# Altium project BMS_AFE.PrjPcb (part 2 of 2)

## Sheet BMS AFE - Thermistors.SchDoc: Title
size B; Organization: Midnight Sun Solar Rayce Car Team; Address1: University of Waterloo; Address2: 200 University Ave W; Address3: Waterloo, ON, Canada; Address4: N2L 3E9; DocumentNumber: 7; SheetNumber: 7; SheetTotal: 7; Website: www.uwmidsun.com; ProjectName: ProjectName
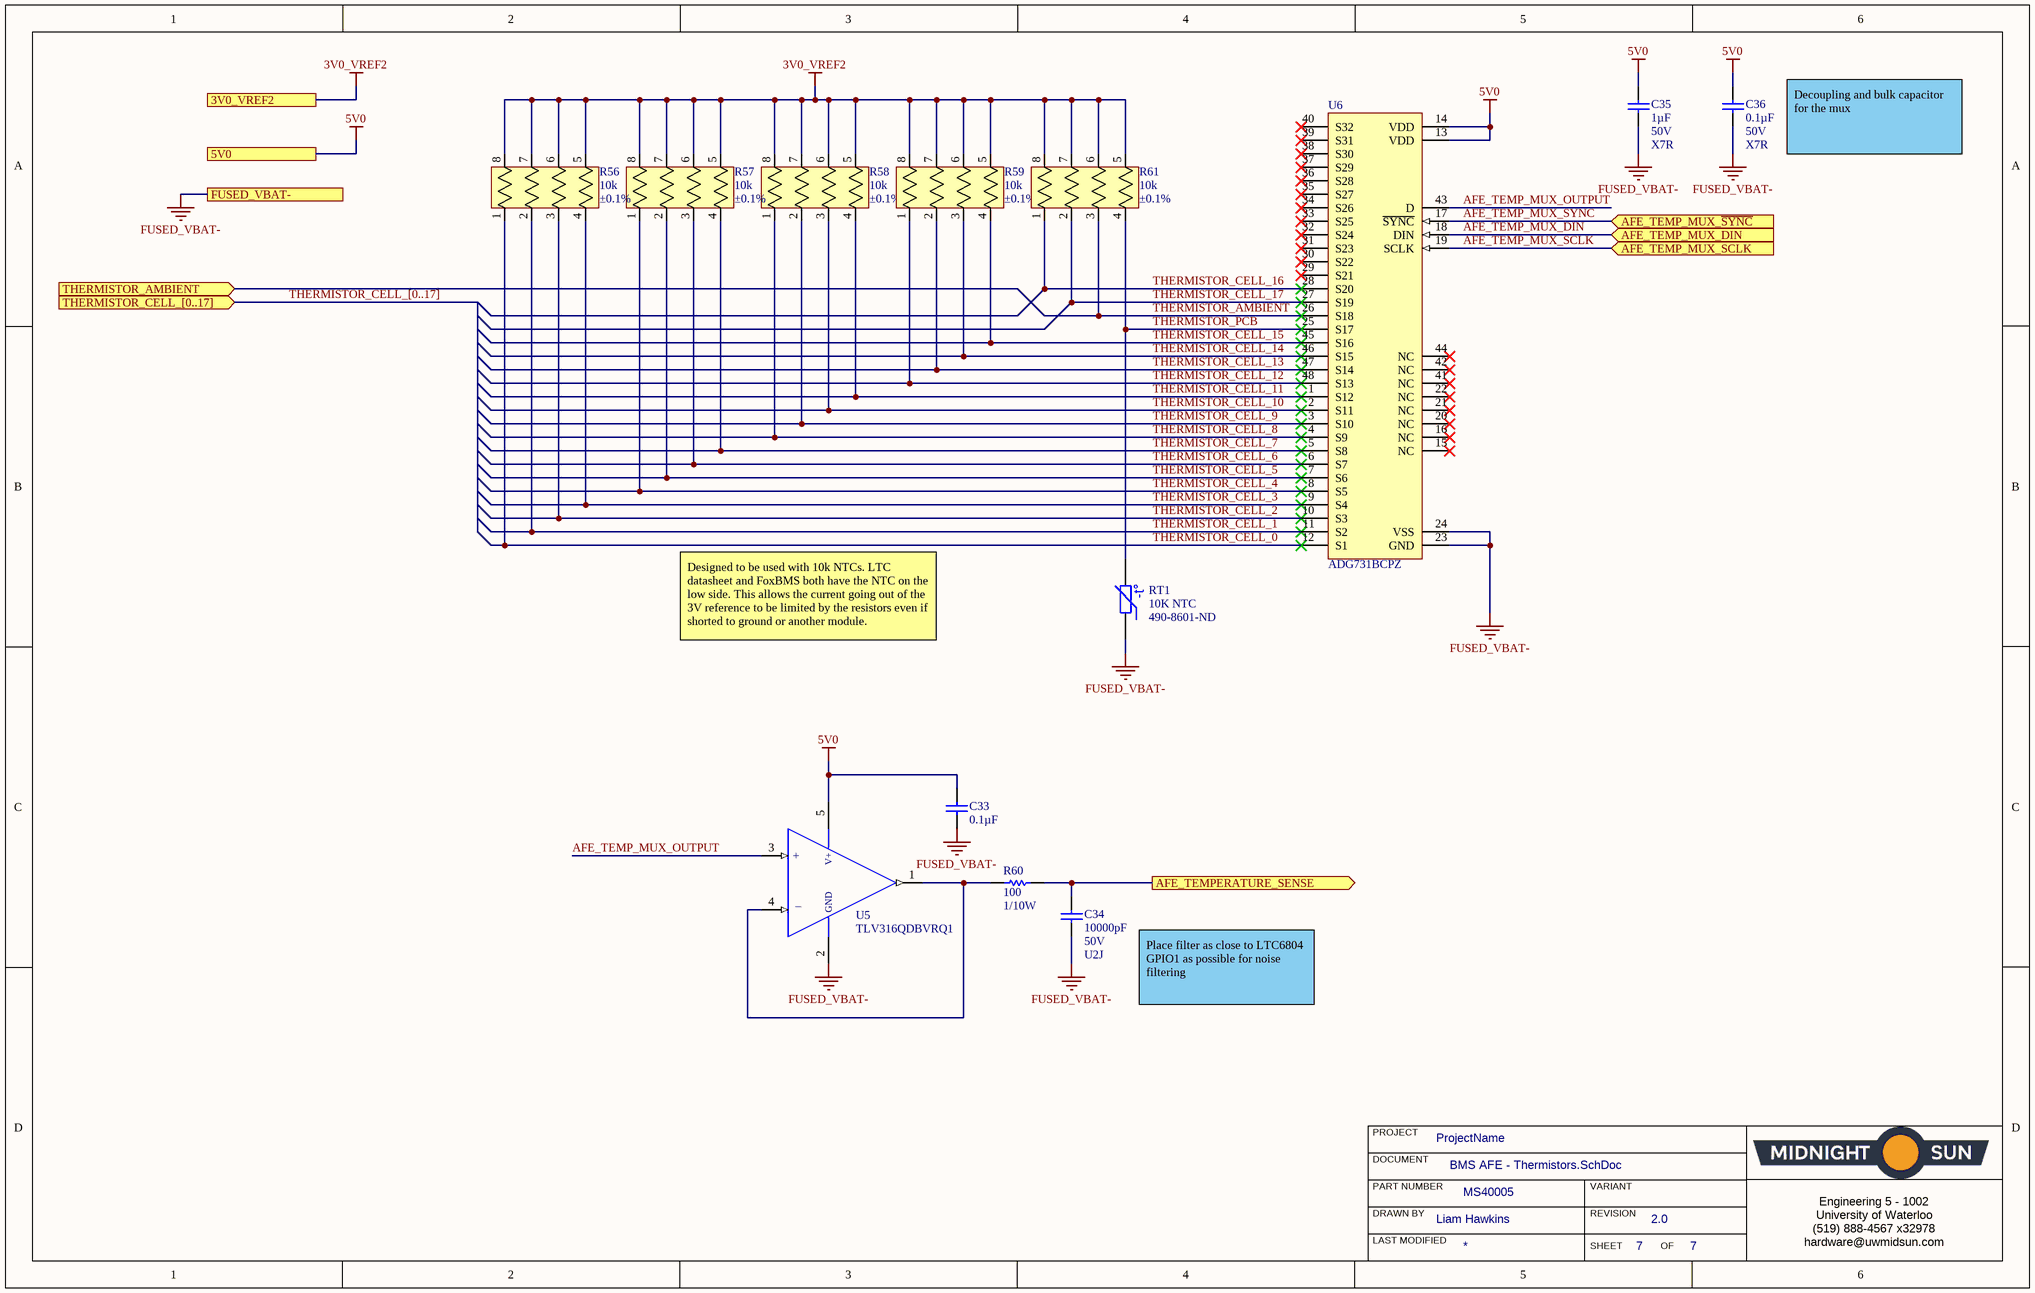
[diagram p5: BMS AFE - Thermistors.SchDoc]

### Parts
C33  Capacitance: 0.1µF  [CAP, 0603]  (hidden comment: CAP CER 0.1UF 50V 10% X7R 0603)
C34  Capacitance: 10000pF  Voltage: 50V  Temperature Coefficient: U2J  [CAP, 0603]  (hidden comment: CAP CER 10nF 50V 5% X7R 0603)
C35  Capacitance: 1µF  Voltage: 50V  Temperature Coefficient: X7R  [CAP, 0603]  (hidden comment: CAP CER 1UF 50V 10% X7R 0603)
C36  Capacitance: 0.1µF  Voltage: 50V  Temperature Coefficient: X7R  [CAP, 0603]  (hidden comment: CAP CER 0.1UF 50V 10% X7R 0603)
R56  Resistance (Ohms): 10k  Tolerance: ±0.1%  [RES ARRAY 4RES 1206]  (hidden comment: RES ARRAY 10K OHM 0.1% 4RES 1206)
R57  Resistance (Ohms): 10k  Tolerance: ±0.1%  [RES ARRAY 4RES 1206]  (hidden comment: RES ARRAY 10K OHM 0.1% 4RES 1206)
R58  Resistance (Ohms): 10k  Tolerance: ±0.1%  [RES ARRAY 4RES 1206]  (hidden comment: RES ARRAY 10K OHM 0.1% 4RES 1206)
R59  Resistance (Ohms): 10k  Tolerance: ±0.1%  [RES ARRAY 4RES 1206]  (hidden comment: RES ARRAY 10K OHM 0.1% 4RES 1206)
R60  Resistance: 100  Power: 1/10W  [RES, 0603]  (hidden comment: RES 100 OHM 1% 1/10W 0603)
R61  Resistance (Ohms): 10k  Tolerance: ±0.1%  [RES ARRAY 4RES 1206]  (hidden comment: RES ARRAY 10K OHM 0.1% 4RES 1206)
RT1  10K NTC  Supplier Part Number 1: 490-8601-ND  [NTC THERMISTOR BEAD]
U5  Manufacturer Part Number 1: TLV316QDBVRQ1  [IC OP AMP GP RR 10MHZ SOT-23-5]  (hidden comment: IC OP AMP GEN PURPOSE RR 10MHZ SOT-23-5)
U6  ADG731BCPZ  [TSQFP50P890X890X160-48M]

### Ports
3V0_VREF2, 5V0, AFE_TEMP_MUX_DIN (in), AFE_TEMP_MUX_SCLK (in), AFE_TEMP_MUX_~{SYNC} (in), AFE_TEMPERATURE_SENSE (out), FUSED_VBAT-, THERMISTOR_AMBIENT (in), THERMISTOR_CELL_[0..17] (in)

### Nets
3V0_VREF2: R56.5 R56.6 R56.7 R56.8 R57.5 R57.6 R57.7 R57.8 R58.5 R58.6 R58.7 R58.8 R59.5 R59.6 R59.7 R59.8 R61.5 R61.6 R61.7 R61.8 ; port 3V0_VREF2
5V0: C33.1 C35.1 C36.1 U5.5(VDD) U6.13(VDD) U6.14(VDD) ; port 5V0
FUSED_VBAT-: C33.2 C34.2 C35.2 C36.2 RT1.1 U5.2(VSS) U6.23(GND) U6.24(VSS) ; port FUSED_VBAT-
AFE_TEMP_MUX_DIN: U6.18(DIN) ; port AFE_TEMP_MUX_DIN
AFE_TEMP_MUX_OUTPUT: U5.3(+IN) U6.43(D)
AFE_TEMP_MUX_~{SYNC}: U6.17(~{SYNC}) ; port AFE_TEMP_MUX_~{SYNC}
AFE_TEMP_MUX_SCLK: U6.19(SCLK) ; port AFE_TEMP_MUX_SCLK
THERMISTOR_AMBIENT: R61.3 U6.26(S18) ; port THERMISTOR_AMBIENT
THERMISTOR_CELL_0: R56.1 U6.12(S1)
THERMISTOR_CELL_1: R56.2 U6.11(S2)
THERMISTOR_CELL_2: R56.3 U6.10(S3)
THERMISTOR_CELL_3: R56.4 U6.9(S4)
THERMISTOR_CELL_4: R57.1 U6.8(S5)
THERMISTOR_CELL_5: R57.2 U6.7(S6)
THERMISTOR_CELL_6: R57.3 U6.6(S7)
THERMISTOR_CELL_7: R57.4 U6.5(S8)
THERMISTOR_CELL_8: R58.1 U6.4(S9)
THERMISTOR_CELL_9: R58.2 U6.3(S10)
THERMISTOR_CELL_10: R58.3 U6.2(S11)
THERMISTOR_CELL_11: R58.4 U6.1(S12)
THERMISTOR_CELL_12: R59.1 U6.48(S13)
THERMISTOR_CELL_13: R59.2 U6.47(S14)
THERMISTOR_CELL_14: R59.3 U6.46(S15)
THERMISTOR_CELL_15: R59.4 U6.45(S16)
THERMISTOR_CELL_16: R61.1 U6.28(S20)
THERMISTOR_CELL_17: R61.2 U6.27(S19)
THERMISTOR_PCB: R61.4 RT1.2 U6.25(S17)
NetC34_1: C34.1 R60.2 ; port AFE_TEMPERATURE_SENSE
NetR60_1: R60.1 U5.1(OUTPUT) U5.4(-IN)

Not connected (* = marked no-connect by the designer): U6 15(NC)* 16(NC)* 20(NC)* 21(NC)* 22(NC)* 29(S21)* 30(S22)* 31(S23)* 32(S24)* 33(S25)* 34(S26)* 35(S27)* 36(S28)* 37(S29)* 38(S30)* 39(S31)* 40(S32)* 41(NC)* 42(NC)* 44(NC)*

### Buses and harness runs
bus THERMISTOR_CELL_[0..17] = port THERMISTOR_CELL_[0..17]

### Notes on the sheet
- Decoupling and bulk capacitor for the mux
- Designed to be used with 10k NTCs. LTC datasheet and FoxBMS both have the NTC on the low side. This allows the current going out of the 3V reference to be limited by the resistors even if shorted to ground or another module.
- Place filter as close to LTC6804 GPIO1 as possible for noise filtering
- PROJECT
- DOCUMENT
- DRAWN BY
- LAST MODIFIED
- PART NUMBER
- REVISION
- SHEET
- VARIANT
- OF
- Engineering 5 - 1002
  University of Waterloo
  (519) 888-4567 x32978
  hardware@uwmidsun.com
- (in symbol IC OP AMP GEN PURPOSE RR 10MHZ SOT-23-5) V+; +; GND; _
- (in symbol NTC THERMISTOR 10K 1% BEAD) -t°

### Library data of the parts
C33 C36 = CAP CER 0.1UF 50V 10% X7R 0603: 0.10µF ±10% 50V Ceramic Capacitor X7R 0603 (1608 Metric); Manufacturer 1: AVX Corporation; Manufacturer Part Number 1: 06035C104KAT2A; Supplier 1: Digi-Key; Supplier Part Number 1: 478-5052-1-ND; Packaging: Cut Tape (CT); Part Status: Active; Operating Temperature: -55°C ~ 125°C; Ratings: -; Mounting Type: Surface Mount, MLCC; Package / Case: 0603 (1608 Metric); Size / Dimension: 0.063" L x 0.032" W (1.60mm x 0.81mm); Height - Seated (Max): -; Thickness (Max): 0.035" (0.90mm); Lead Spacing: -; Lead Style: -; ComponentLink1URL: http://datasheets.avx.com/X7RDielectric.pdf; ComponentLink1Description: http://datasheets.avx.com/X7RDielectric.pdf; Tolerance: ±10%
  C33: Voltage: 50V; Temperature Coefficient: X7R
C34 = CAP CER 10nF 50V 5% X7R 0603: 10000pF ±5% 50V Ceramic Capacitor U2J 0603 (1608 Metric); Manufacturer 1: KEMET; Manufacturer Part Number 1: C0603C103J5JAC7867; Supplier 1: Digi-Key; Supplier Part Number 1: 399-13384-1-ND; Packaging: Cut Tape (CT); Part Status: Active; Operating Temperature: -55°C ~ 125°C; Ratings: -; Failure Rate: -; Mounting Type: Surface Mount, MLCC; Package / Case: 0603 (1608 Metric); Size / Dimension: 0.063" L x 0.032" W (1.60mm x 0.80mm); Height - Seated (Max): -; Thickness (Max): 0.034" (0.87mm); Lead Spacing: -; Lead Style: -; ComponentLink1URL: http://www.kemet.com/docfinder?Partnumber=C0603C103J5JAC7867; ComponentLink1Description: http://www.kemet.com/docfinder?Partnumber=C0603C103J5JAC7867; Tolerance: ±5%
C35 = CAP CER 1UF 50V 10% X7R 0603: 1µF ±10% 50V Ceramic Capacitor X7R 0603 (1608 Metric); Manufacturer 1: Taiyo Yuden; Manufacturer Part Number 1: UMK107AB7105KA-T; Supplier 1: Digi-Key; Supplier Part Number 1: 587-3247-1-ND; Packaging: Cut Tape (CT); Part Status: Active; Operating Temperature: -55°C ~ 125°C; Ratings: -; Mounting Type: Surface Mount, MLCC; Package / Case: 0603 (1608 Metric); Size / Dimension: 0.063" L x 0.031" W (1.60mm x 0.80mm); Height - Seated (Max): -; Thickness (Max): 0.037" (0.95mm); Lead Spacing: -; Lead Style: -; ComponentLink1URL: http://www.yuden.co.jp/productdata/catalog/en/mlcc_all_e.pdf; ComponentLink1Description: http://www.yuden.co.jp/productdata/catalog/en/mlcc_all_e.pdf; Tolerance: ±10%
R56-R59 R61 = RES ARRAY 10K OHM 0.1% 4RES 1206: 10k Ohm ±0.1% 100mW Power Per Element Isolated 4 Resistor Network/Array ±25ppm/°C 1206 (3216 Metric), Convex, Long Side Terminals; Manufacturer: Vishay Beyschlag; Manufacturer Part Number: ACASA1002S1002P100; Number of Resistors: 4; Resistor Matching Ratio: ±0.05%; Resistor-Ratio-Drift: ±15 ppm/°C; Supplier 1: Digi-Key; RoHS: RoHS Compliant; Category: Resistors; Stock 1: 18780; Pricing 1: 1=1.19, 10=0.99, 25=0.8484, 50=0.7636, 100=0.6647, 250=0.59392, 500=0.4808 (CAD); Packaging: Cut Tape (CT); Part Status: Active; Circuit Type: Isolated; Power Per Element: 100mW; Temperature Coefficient: ±25ppm/°C; Operating Temperature: -55°C ~ 125°C; Applications: Voltage Divider (TCR Matched); Mounting Type: Surface Mount; Package / Case: 1206 (3216 Metric), Convex, Long Side Terminals; Supplier Device Package: 0612; Size / Dimension: 0.126" L x 0.059" W (3.20mm x 1.50mm); Height - Seated (Max): 0.022" (0.55mm); ComponentLink1URL: http://www.vishay.com/docs/28751/acasprec.pdf; ComponentLink1Description: http://www.vishay.com/docs/28751/acasprec.pdf; Supplier Part Number 1: 749-1023-1-ND
R60 = RES 100 OHM 1% 1/10W 0603: 100 Ohm ±1% 0.1W, 1/10W Chip Resistor 0603 (1608 Metric) Moisture Resistant Thick Film; Manufacturer 1: Yageo; Manufacturer Part Number 1: RC0603FR-07100RL; Temperature Coefficient: ±100ppm/°C; Supplier 1: Digi-Key; Supplier Part Number 1: 311-100HRCT-ND; Packaging: Cut Tape (CT); Part Status: Active; Composition: Thick Film; Operating Temperature: -55°C ~ 155°C; Package / Case: 0603 (1608 Metric); Supplier Device Package: 0603; Size / Dimension: 0.063" L x 0.031" W (1.60mm x 0.80mm); Height - Seated (Max): 0.022" (0.55mm); Failure Rate: -; ComponentLink1URL: http://www.yageo.com/documents/recent/PYu-RC_Group_51_RoHS_L_7.pdf; ComponentLink1Description: http://www.yageo.com/documents/recent/PYu-RC_Group_51_RoHS_L_7.pdf; Tolerance: ±1%
RT1 = NTC THERMISTOR 10K 1% BEAD: NTC Thermistor 10k Bead; Manufacturer: Murata Electronics North America; Manufacturer Part Number: NXRT15XH103FA1B030; Resistance Tolerance: ±1%; B25/50: 3380K; B25/85: 3434K; B25/100: 3455K; Supplier 1: Digi-Key; RoHS: RoHS Compliant; Category: Sensors, Transducers; Stock 1: 25017; Pricing 1: 1=0.96, 5=0.91, 10=0.792, 25=0.696, 50=0.5784, 100=0.4925, 500=0.42834, 1000=0.3748, 5000=0.33197 (CAD); Packaging: Bulk; Part Status: Active; Resistance in Ohms @ 25°C: 10k; B Value Tolerance: ±1%; B0/50: -; B25/75: -; Operating Temperature: -40°C ~ 125°C; Length - Lead Wire: -; Mounting Type: Through Hole; Package / Case: Bead; ComponentLink1URL: https://www.murata.com/~/media/webrenewal/support/library/catalog/products/thermistor/ntc/r44e.ashx; ComponentLink1Description: https://www.murata.com/~/media/webrenewal/support/library/catalog/products/thermistor/ntc/r44e.ashx
U5 = IC OP AMP GEN PURPOSE RR 10MHZ SOT-23-5: General Purpose Amplifier 1 Circuit Rail-to-Rail SOT-23-5; Manufacturer 1: Texas Instruments; Description 1: IC OP AMP GP RR 10MHZ 5-SOT-23; Number of Circuits: 1; Slew Rate: 6 V/µs; Current - Supply: 400µA; Current - Output / Channel: 50mA; Voltage - Supply, Single/Dual (±): 1.8 V ~ 5.5 V, ±0.9 V ~ 2.75 V; Supplier 1: Digi-Key; Supplier Part Number 1: 296-45323-1-ND; RoHS: RoHS Compliant; Category: Integrated Circuits (ICs); Stock 1: 1747; Pricing 1: 1=1.33, 10=1.185, 100=0.9234, 500=0.76276, 1000=0.60218 (CAD); Packaging: Cut Tape (CT); Part Status: Active; Amplifier Type: General Purpose; Output Type: Rail-to-Rail; -3db Bandwidth: -; Operating Temperature: -40°C ~ 125°C; Mounting Type: Surface Mount; Package / Case: SC-74A, SOT-753; Supplier Device Package: SOT-23-5; ComponentLink1URL: http://www.ti.com/lit/ds/symlink/tlv316-q1.pdf; ComponentLink1Description: http://www.ti.com/lit/ds/symlink/tlv316-q1.pdf
U6 = IC 32x1 Multiplexer ADG731BCPZ: IC MULTIPLEXER 32X1 48LFCSP; Manufacturer: Analog Devices Inc.; Manufacturer Part Number: ADG731BSUZ; Supplier 1: Digi-Key; Supplier Part Number 1: ADG731BSUZ-ND

## Sheet BMS AFE - Connectors.SchDoc: Title
size B; Organization: Midnight Sun Solar Rayce Car Team; Address1: University of Waterloo; Address2: 200 University Ave W; Address3: Waterloo, ON, Canada; Address4: N2L 3E9; DocumentNumber: 2; SheetNumber: 2; SheetTotal: 7; Website: www.uwmidsun.com; ProjectName: ProjectName
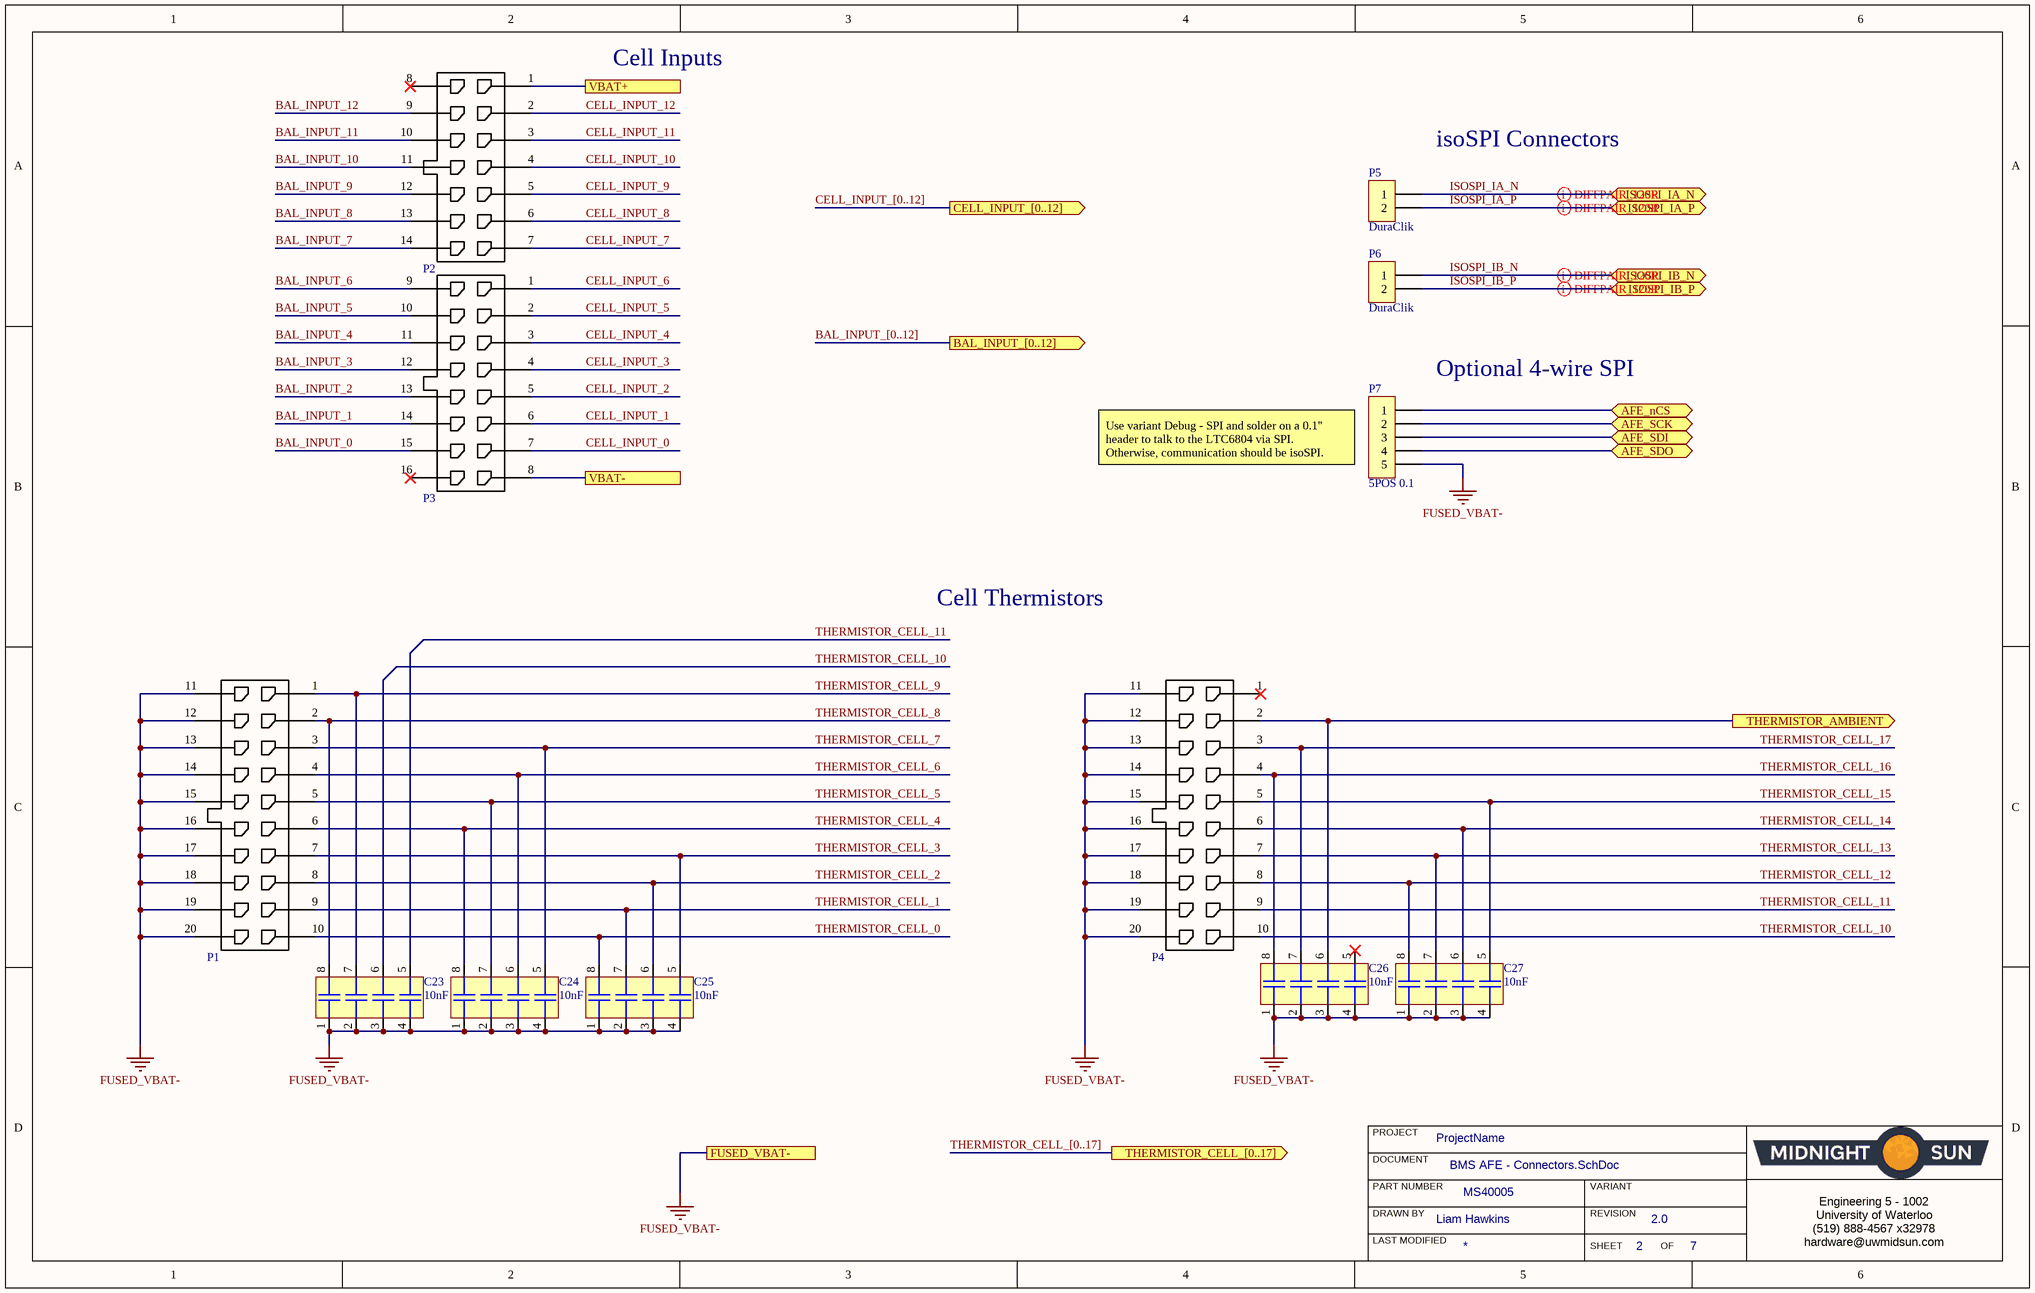
[diagram p6: BMS AFE - Connectors.SchDoc]

### Parts
C23  Capacitance: 10nF  [CAP ARRAY 4 POS 0612]  (hidden comment: CAP ARRAY 10000PF 50V X7R 0612)
C24  Capacitance: 10nF  [CAP ARRAY 4 POS 0612]  (hidden comment: CAP ARRAY 10000PF 50V X7R 0612)
C25  Capacitance: 10nF  [CAP ARRAY 4 POS 0612]  (hidden comment: CAP ARRAY 10000PF 50V X7R 0612)
C26  Capacitance: 10nF  [CAP ARRAY 4 POS 0612]  (hidden comment: CAP ARRAY 10000PF 50V X7R 0612)
C27  Capacitance: 10nF  [CAP ARRAY 4 POS 0612]  (hidden comment: CAP ARRAY 10000PF 50V X7R 0612)
P1  CONN R/A 20POS 3MM  [CONN, R/A 20POS MICRO-FIT 3mm]  (value not drawn)
P2  CONN R/A 14POS 3MM  [CONN, R/A 14POS MICRO-FIT 3mm]  (value not drawn)
P3  CONN R/A 16POS 3MM  [CONN, R/A 16POS MICRO-FIT 3mm]  (value not drawn)
P4  CONN R/A 20POS 3MM  [CONN, R/A 20POS MICRO-FIT 3mm]  (value not drawn)
P5  Series: DuraClik  [CONN, 2POS Dura-Click]  (hidden comment: CONN 2POS DURA-CLIK 0.079")
P6  Series: DuraClik  [CONN, 2POS Dura-Click]  (hidden comment: CONN 2POS DURA-CLIK 0.079")
P7  5POS 0.1  [CONN, 5POS HEADR 0.1"]

### Ports
AFE_nCS (bidir), AFE_SCK (bidir), AFE_SDI (bidir), AFE_SDO (bidir), BAL_INPUT_[0..12] (out), CELL_INPUT_[0..12] (out), FUSED_VBAT-, ISOSPI_IA_N (bidir), ISOSPI_IA_P (bidir), ISOSPI_IB_N (bidir), ISOSPI_IB_P (bidir), THERMISTOR_AMBIENT (out), THERMISTOR_CELL_[0..17] (out), VBAT+, VBAT-

### Nets
FUSED_VBAT-: C23.1 C23.2 C23.3 C23.4 C24.1 C24.2 C24.3 C24.4 C25.1 C25.2 C25.3 C25.4 C26.1 C26.2 C26.3 C26.4 C27.1 C27.2 C27.3 C27.4 P1.11 P1.12 P1.13 P1.14 P1.15 P1.16 P1.17 P1.18 P1.19 P1.20 P4.11 P4.12 P4.13 P4.14 P4.15 P4.16 P4.17 P4.18 P4.19 P4.20 P7.5 ; port FUSED_VBAT-
VBAT+: P2.1 ; port VBAT+
VBAT-: P3.8 ; port VBAT-
BAL_INPUT_0: P3.15
BAL_INPUT_1: P3.14
BAL_INPUT_2: P3.13
BAL_INPUT_3: P3.12
BAL_INPUT_4: P3.11
BAL_INPUT_5: P3.10
BAL_INPUT_6: P3.9
BAL_INPUT_7: P2.14
BAL_INPUT_8: P2.13
BAL_INPUT_9: P2.12
BAL_INPUT_10: P2.11
BAL_INPUT_11: P2.10
BAL_INPUT_12: P2.9
CELL_INPUT_0: P3.7
CELL_INPUT_1: P3.6
CELL_INPUT_2: P3.5
CELL_INPUT_3: P3.4
CELL_INPUT_4: P3.3
CELL_INPUT_5: P3.2
CELL_INPUT_6: P3.1
CELL_INPUT_7: P2.7
CELL_INPUT_8: P2.6
CELL_INPUT_9: P2.5
CELL_INPUT_10: P2.4
CELL_INPUT_11: P2.3
CELL_INPUT_12: P2.2
ISOSPI_IA_N: P5.1 ; port ISOSPI_IA_N
ISOSPI_IA_P: P5.2 ; port ISOSPI_IA_P
ISOSPI_IB_N: P6.1 ; port ISOSPI_IB_N
ISOSPI_IB_P: P6.2 ; port ISOSPI_IB_P
THERMISTOR_CELL_0: C25.8 P1.10
THERMISTOR_CELL_1: C25.7 P1.9
THERMISTOR_CELL_2: C25.6 P1.8
THERMISTOR_CELL_3: C25.5 P1.7
THERMISTOR_CELL_4: C24.8 P1.6
THERMISTOR_CELL_5: C24.7 P1.5
THERMISTOR_CELL_6: C24.6 P1.4
THERMISTOR_CELL_7: C24.5 P1.3
THERMISTOR_CELL_8: C23.8 P1.2
THERMISTOR_CELL_9: C23.7 P1.1
THERMISTOR_CELL_10: C23.6 P4.10
THERMISTOR_CELL_11: C23.5 P4.9
THERMISTOR_CELL_12: C27.8 P4.8
THERMISTOR_CELL_13: C27.7 P4.7
THERMISTOR_CELL_14: C27.6 P4.6
THERMISTOR_CELL_15: C27.5 P4.5
THERMISTOR_CELL_16: C26.8 P4.4
THERMISTOR_CELL_17: C26.7 P4.3
NetC26_6: C26.6 P4.2 ; port THERMISTOR_AMBIENT
NetP7_1: P7.1 ; port AFE_nCS
NetP7_2: P7.2 ; port AFE_SCK
NetP7_3: P7.3 ; port AFE_SDI
NetP7_4: P7.4 ; port AFE_SDO

Not connected (* = marked no-connect by the designer): C26 5*; P2 8*; P3 16*; P4 1*

### Buses and harness runs
bus BAL_INPUT_[0..12] = port BAL_INPUT_[0..12]
bus CELL_INPUT_[0..12] = port CELL_INPUT_[0..12]
bus THERMISTOR_CELL_[0..17] = port THERMISTOR_CELL_[0..17]

### Layout directives
differential pair: ISOSPI_IA_N, ISOSPI_IA_P, ISOSPI_IB_N, ISOSPI_IB_P

### Notes on the sheet
- Cell Inputs
- isoSPI Connectors
- (near P7) Optional 4-wire SPI
- (near P7) Use variant Debug - SPI and solder on a 0.1" header to talk to the LTC6804 via SPI. Otherwise, communication should be isoSPI.
- Cell Thermistors
- PROJECT
- DOCUMENT
- DRAWN BY
- LAST MODIFIED
- PART NUMBER
- REVISION
- SHEET
- VARIANT
- OF
- Engineering 5 - 1002
  University of Waterloo
  (519) 888-4567 x32978
  hardware@uwmidsun.com

### Library data of the parts
C23-C27 = CAP ARRAY 10000PF 50V X7R 0612: 10000pF Isolated Capacitor  Array 50V X7R 0612 (1632 Metric); Manufacturer: Yageo; Manufacturer Part Number: CA0612KRX7R9BB103; Dielectric Material: Ceramic; Tolerance: 10%; Number of Capacitors: 4; Description: Cap Ceramic Array 0.01uF 50V X7R 10% 0612 SMD 4 Capacitor 125C Automotive T/R; Mount: Surface Mount; Case/Package: 0612; Case Code (Metric): 1632; Case Code (Imperial): 0612; Number of Terminals: 8; Min Operating Temperature: -55°C; Max Operating Temperature: 125°C; Package Quantity: 4000; Voltage Rating: 50V; Packaging: Tape and Reel; Dielectric: X7R; Circuit Type: Isolated; Termination: SMD/SMT; Composition: Ceramic; Voltage Rating (DC): 50V; Length: 3.2mm; Height: 0.8mm; Width: 0.063inch; Height - Seated (Max): 0.035inch; Terminal Pitch: 0.8mm; Depth: 1.6mm; Radiation Hardening: No; Lead Free: Lead Free; ComponentLink1URL: https://datasheet.ciiva.com/129/upy-4c-array-16v-to-50v-3-129442.pdf?src-supplier=Digi-Key; ComponentLink1Description: https://datasheet.ciiva.com/129/upy-4c-array-16v-to-50v-3-129442.pdf?src-supplier=Digi-Key; ComponentLink2URL: https://datasheet.ciiva.com/16747/ca0508jrnpo9bn150-16747477.pdf?src-supplier=Future+Electronics; ComponentLink2Description: https://datasheet.ciiva.com/16747/ca0508jrnpo9bn150-16747477.pdf?src-supplier=Future+Electronics; ComponentLink3URL: https://datasheet.ciiva.com/15189/getdatasheetpartid-371163-15189099.pdf?src-supplier=Verical; ComponentLink3Description: https://datasheet.ciiva.com/15189/getdatasheetpartid-371163-15189099.pdf?src-supplier=Verical; Pricing 1: 1=0.41000, 10=0.28300, 100=0.16970, 500=0.12728, 1000=0.10749 (USD); RoHS: Yes; Stock 1: 4330; Supplier 1: Digi-Key; Supplier Part Number 1: 311-2074-1-ND
P1 P4 = CONN R/A 20POS 3MM: Connector Header Through Hole, Right Angle 20 position 0.118" (3.00mm); Manufacturer: Molex; Manufacturer Part Number: 0430452021; Number of Positions: 20; Connector Type: Male Pin; Contact Resistance: 10mR; Row Spacing: 0.118inch; Description: Conn Wire to Board HDR 20 POS 3mm Solder RA Thru-Hole Micro-Fit 3.0™ Tray; Mount: Through Hole; Contact Plating: Tin; Color: Black; Contact Material: Brass; Housing Material: Polymer; Housing Color: Black; Min Operating Temperature: -40°C; Max Operating Temperature: 105°C; Packaging: Tray; Number of Rows: 2; Termination: Solder; Orientation: Right Angle; Fastening Type: Ramp; Number of Contacts: 20; Length: 34.15mm; Pitch: 3mm; Depth: 12.2mm; ComponentLink1URL: https://datasheet.ciiva.com/6841/430450223-sd-6841489.pdf?src-supplier=Digi-Key; ComponentLink1Description: https://datasheet.ciiva.com/6841/430450223-sd-6841489.pdf?src-supplier=Digi-Key; ComponentLink2URL: https://datasheet.ciiva.com/10077/0430452021-pcb-headers-10077829.pdf?src-supplier=Avnet; ComponentLink2Description: https://datasheet.ciiva.com/10077/0430452021-pcb-headers-10077829.pdf?src-supplier=Avnet; Pricing 1: 1=5.68000, 10=5.44900, 25=4.99520, 50=4.76820, 100=4.54120, 250=3.97356, 648=3.86002, 1296=3.29237, 2592=3.06531 (USD); RoHS: Yes; Stock 1: 1054; Supplier 1: Digi-Key; Supplier Part Number 1: WM20137-ND
P2 = CONN R/A 14POS 3MM: Connector Header Through Hole, Right Angle 14 position 0.118" (3.00mm); Manufacturer: Molex; Manufacturer Part Number: 0430451421; Number of Positions: 14; Contact Resistance: 10mR; Connector Type: Male Pin; Max Voltage Rating (AC): 250V; Row Spacing: 0.118inch; Description: Conn Wire to Board HDR 14 POS 3mm Solder RA Thru-Hole Micro-Fit 3.0™ Tray; Mount: Through Hole; Contact Plating: Tin; Color: Black; Contact Material: Brass; Housing Material: Polymer; Housing Color: Black; Min Operating Temperature: -40°C; Max Operating Temperature: 105°C; Packaging: Tray; Number of Rows: 2; Termination: Solder; Number of Contacts: 14; Package Quantity: 936; Orientation: Right Angle; Fastening Type: Ramp; Max Voltage Rating (DC): 250V; Length: 25.15mm; Pitch: 3mm; Depth: 12.2mm; ComponentLink1URL: https://datasheet.ciiva.com/6841/430450223-sd-6841489.pdf?src-supplier=Digi-Key; ComponentLink1Description: https://datasheet.ciiva.com/6841/430450223-sd-6841489.pdf?src-supplier=Digi-Key; Pricing 1: 1=4.12000, 10=3.95700, 25=3.62760, 50=3.46260, 100=3.29780, 250=2.88556, 936=2.55579, 1872=2.30846, 2808=2.22601 (USD); RoHS: Yes; Stock 1: 776; Supplier 1: Digi-Key; Supplier Part Number 1: WM14571-ND
P3 = CONN R/A 16POS 3MM: Connector Header Through Hole, Right Angle 16 position 0.118" (3.00mm); Manufacturer Part Number: 0430451621; Manufacturer: Molex; Contact Resistance: 10mR; Number of Positions: 16; Connector Type: Male Pin; Row Spacing: 0.118inch; Mount: Through Hole; Contact Plating: Tin; Contact Material: Brass; Color: Black; Housing Material: Polymer; Housing Color: Black; Min Operating Temperature: -40°C; Max Operating Temperature: 105°C; Packaging: Tray; Number of Rows: 2; Termination: Solder; Number of Contacts: 16; Orientation: Right Angle; Package Quantity: 792; Fastening Type: Ramp; Length: 28.15mm; Pitch: 3mm; Depth: 12.2mm; ComponentLink1URL: https://datasheet.ciiva.com/6841/430450223-sd-6841489.pdf?src-supplier=Digi-Key; ComponentLink1Description: https://datasheet.ciiva.com/6841/430450223-sd-6841489.pdf?src-supplier=Digi-Key; Pricing 1: 1=4.58000, 10=4.39500, 25=4.02880, 50=3.84560, 100=3.66240, 250=3.20460, 792=2.83836, 1584=2.56368, 3168=2.47212 (USD); RoHS: Yes; Stock 1: 701; Supplier 1: Digi-Key; Supplier Part Number 1: WM14573-ND
P5 P6 = CONN 2POS DURA-CLIK 0.079": 2 Positions Header, Shrouded Connector 0.079" (2.00mm) Surface Mount, Right Angle Tin; Manufacturer 1: Molex, LLC; Manufacturer Part Number 1: 5023520200; Style: Board to Cable/Wire; Shrouding: Shrouded - 4 Wall; Number of Positions: 2; Number of Positions Loaded: All; Contact Length - Mating: 0.135" (3.45mm); Material Flammability Rating: UL94 V-0; Mated Stacking Heights: 11mm; Supplier 1: Digi-Key; Supplier Part Number 1: WM7169CT-ND; Packaging: Cut Tape (CT); Part Status: Active; Connector Type: Header; Contact Type: Male Pin; Number of Rows: 1; Row Spacing - Mating: -; Mounting Type: Surface Mount, Right Angle; Termination: Solder; Fastening Type: Latch Lock; Contact Length - Post: -; Overall Contact Length: -; Insulation Height: 0.252" (6.40mm); Contact Shape: Square; Contact Finish - Mating: Tin; Contact Finish Thickness - Mating: -; Contact Finish - Post: Tin; Contact Material: Copper Alloy; Insulation Material: Polyamide (PA), Nylon; Operating Temperature: -; Ingress Protection: -; Insulation Color: Natural; Current Rating: -; Contact Finish Thickness - Post: -; ComponentLink1URL: http://www.molex.com/pdm_docs/sd/5023520200_sd.pdf; ComponentLink1Description: http://www.molex.com/pdm_docs/sd/5023520200_sd.pdf; Voltage: -; Pitch - Mating: 0.079" (2.00mm)
P7 = CONN 5POS HEADR MALE 0.1in: 5 Positions Header, Breakaway Connector 0.100" (2.54mm) Through Hole Tin; Manufacturer 1: Molex; Manufacturer Part Number 1: 0022284050; Description 1: Conn Unshrouded Header HDR 5 POS 2.54mm Solder ST Thru-Hole KK® Bag; Contact Resistance: 20mR; Number of Positions: 5; Gender: Male; Connector Type: Male Pin; Max Voltage Rating (AC): 250V; Supplier 1: Digi-Key; Supplier Part Number 1: WM50014-05-ND; Stock 1: 3161; Pricing 1: 1=0.22, 10=0.21, 25=0.1796, 50=0.157, 100=0.1459, 250=0.129, 500=0.1234 (USD); Mount: Through Hole; Colour: Black; Contact Plating: Nickel,Tin; Contact Material: Bronze,Brass; Housing Colour: Black; Housing Material: Nylon; Min Operating Temperature: 0°C; Max Operating Temperature: 75°C; Packaging: Bulk; Number of Rows: 1; Termination: Solder; Number of Contacts: 5; Orientation: Straight; Max Voltage Rating (DC): 250V; Length: 12.7mm; Pitch: 2.54mm; Depth: 2.49mm; Contact Mating Length: 0.24inch; ComponentLink1URL: https://datasheet.ciiva.com/6814/022284363-sd-6814049.pdf; ComponentLink1Description: https://datasheet.ciiva.com/6814/022284363-sd-6814049.pdf; ComponentLink2URL: https://datasheet.ciiva.com/14804/179390022284050-pcb-headers-14804361.pdf; ComponentLink2Description: https://datasheet.ciiva.com/14804/179390022284050-pcb-headers-14804361.pdf; ComponentLink3URL: https://datasheet.ciiva.com/15217/getdatasheetpartid-256138-15217709.pdf; ComponentLink3Description: https://datasheet.ciiva.com/15217/getdatasheetpartid-256138-15217709.pdf

## Sheet BMS AFE - Regulator.SchDoc: Title
size B; Organization: Midnight Sun Solar Rayce Car Team; Address1: University of Waterloo; Address2: 200 University Ave W; Address3: Waterloo, ON, Canada; Address4: N2L 3E9; Website: www.uwmidsun.com; ProjectName: ProjectName
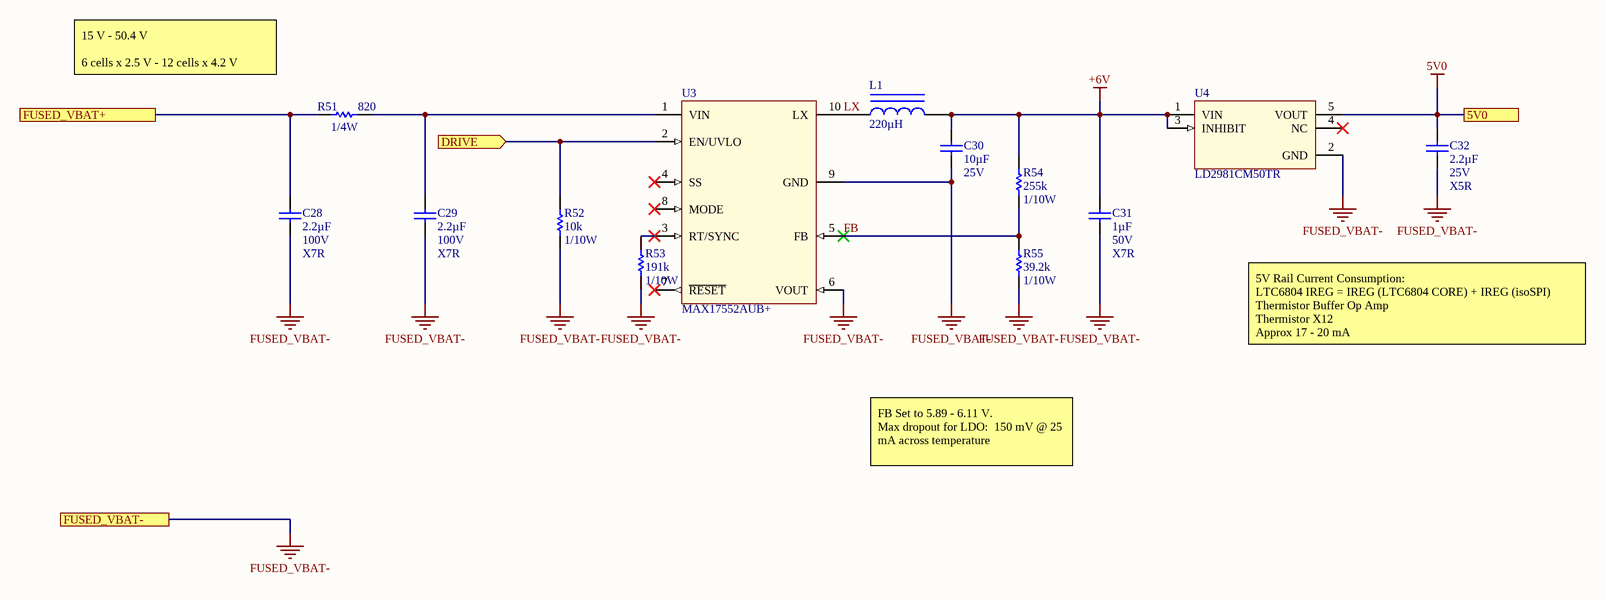
[diagram p7: BMS AFE - Regulator.SchDoc]

### Parts
C28  Capacitance: 2.2µF  Voltage: 100V  Temperature Coefficient: X7R  [CAP, 1206]  (hidden comment: CAP CER 2.2UF 100V ±20% X7R 1206)
C29  Capacitance: 2.2µF  Voltage: 100V  Temperature Coefficient: X7R  [CAP, 1206]  (hidden comment: CAP CER 2.2UF 100V ±20% X7R 1206)
C30  Capacitance: 10µF  Voltage - Rated: 25V  [CAP, 0805]  (hidden comment: CAP CER 10uF 25V 10% X5R 0805)
C31  Capacitance: 1µF  Voltage: 50V  Temperature Coefficient: X7R  [CAP, 0603]  (hidden comment: CAP CER 1UF 50V 10% X7R 0603)
C32  Capacitance: 2.2µF  Voltage: 25V  Temperature Coefficient: X5R  [CAP, 0603]  (hidden comment: CAP CER 2.2UF 25V 10% X5R 0603)
L1  Inductance: 220µH  [INDP6060X23N]  (hidden comment: IND 220uH 0.59A 20%)
R51  Resistance: 820  Power: 1/4W  [RES, 0603]  (hidden comment: RES 820 OHM 5% 1/4W 0603)
R52  Resistance: 10k  Power: 1/10W  [RES, 0603]  (hidden comment: RES 10K OHM 1% 1/10W 0603)
R53  Resistance: 191k  Power: 1/10W  [RES, 0603]  (hidden comment: RES 191K OHM 1% 1/10W 0603)
R54  Resistance (Ohms): 255k  Power (Watts): 1/10W  [RES, 0603]  (hidden comment: RES 255K OHM 1% 1/10W 0603)
R55  Resistance: 39.2k  Power: 1/10W  [RES, 0603]  (hidden comment: RES 39.2K OHM 1% 1/10W 0603)
U3  Manufacturer Part Number 1: MAX17552AUB+  [TSSOP50P490X110-10N]  (hidden comment: IC REG BUCK ADJ 0.1A 10UMAX)
U4  Manufacturer Part Number 1: LD2981CM50TR  [SOT95P280X145-5N]  (hidden comment: IC REG LDO 5V 0.1A SOT23-5)

### Ports
5V0, DRIVE (in), FUSED_VBAT+, FUSED_VBAT-

### Nets
5V0: C32.1 U4.5(VOUT) ; port 5V0
+6V: C30.1 C31.1 L1.2 R54.2 U4.1(VIN) U4.3(INHIBIT)
FUSED_VBAT-: C28.2 C29.2 C30.2 C31.2 C32.2 R52.2 R53.2 R55.2 U3.6(VOUT) U3.9(GND) U4.2(GND) ; port FUSED_VBAT-
FB: R54.1 R55.1 U3.5(FB)
LX: L1.1 U3.10(LX)
NetC28_1: C28.1 R51.1 ; port FUSED_VBAT+
NetC29_1: C29.1 R51.2 U3.1(VIN)
NetR52_1: R52.1 U3.2(EN/UVLO) ; port DRIVE
NetR53_1: R53.1 U3.3(RT/SYNC)

Not connected (* = marked no-connect by the designer): U3 4(SS)* 7(~{RESET})* 8(MODE)*; U4 4(NC)*

### Notes on the sheet
- 15 V - 50.4 V
  6 cells x 2.5 V - 12 cells x 4.2 V
- 5V Rail Current Consumption:
  LTC6804 IREG = IREG (LTC6804 CORE) + IREG (isoSPI)
  Thermistor Buffer Op Amp
  Thermistor X12
  Approx 17 - 20 mA
- FB Set to 5.89 - 6.11 V.
  Max dropout for LDO:  150 mV @ 25 mA across temperature
- PROJECT
- DOCUMENT
- DRAWN BY
- LAST MODIFIED
- PART NUMBER
- REVISION
- SHEET
- VARIANT
- OF
- Engineering 5 - 1002
  University of Waterloo
  (519) 888-4567 x32978
  hardware@uwmidsun.com

### Library data of the parts
C28 C29 = CAP CER 2.2UF 100V ±20% X7R 1206: 2.2µF ±20% 100V Ceramic Capacitor X7R 1206 (3216 Metric); Manufacturer 1: Murata Electronics North America; Manufacturer Part Number 1: GRM31CR72A225MA73L; Supplier 1: Digi-Key; Supplier Part Number 1: 490-12773-1-ND; Packaging: Cut Tape (CT); Part Status: Active; Operating Temperature: -55°C ~ 125°C; Ratings: -; Mounting Type: Surface Mount, MLCC; Package / Case: 1206 (3216 Metric); Size / Dimension: 0.126" L x 0.063" W (3.20mm x 1.60mm); Height - Seated (Max): -; Thickness (Max): 0.071" (1.80mm); Lead Spacing: -; Lead Style: -; ComponentLink1URL: http://www.murata.com/~/media/webrenewal/support/library/catalog/products/capacitor/mlcc/c02e.ashx; ComponentLink1Description: http://www.murata.com/~/media/webrenewal/support/library/catalog/products/capacitor/mlcc/c02e.ashx; Tolerance: ±20%
C30 = CAP CER 10uF 25V 10% X5R 0805: 10µF ±10% 25V Ceramic Capacitor X5R 0805 (2012 Metric); Manufacturer: Murata Electronics North America; Manufacturer Part Number: GRM21BR61E106KA73L; Supplier 1: Digi-Key; Supplier Part Number 1: 490-5523-1-ND; Packaging: Cut Tape (CT); Part Status: Active; Operating Temperature: -55°C ~ 85°C; Ratings: -; Mounting Type: Surface Mount, MLCC; Package / Case: 0805 (2012 Metric); Size / Dimension: 0.079" L x 0.049" W (2.00mm x 1.25mm); Height - Seated (Max): -; Thickness (Max): 0.053" (1.35mm); Lead Spacing: -; Lead Style: -; ComponentLink1URL: http://search.murata.co.jp/Ceramy/image/img/A01X/G101/ENG/GRM21BR61E106KA73-01.pdf; ComponentLink1Description: http://search.murata.co.jp/Ceramy/image/img/A01X/G101/ENG/GRM21BR61E106KA73-01.pdf; Tolerance: ±10%; Temperature Coefficient: X5R; RoHS: RoHS Compliant; Category: Capacitors; Stock 1: 1695157; Features: -; Applications: General Purpose; Pricing 1: 1=0.3, 10=0.214, 100=0.1008, 500=0.07068, 1000=0.05851 (CAD)
C31 = CAP CER 1UF 50V 10% X7R 0603: as C35 on sheet BMS AFE - Thermistors; Supplier 1: Digi-Key; Supplier Part Number 1: 587-3247-1-ND; Packaging: Cut Tape (CT); Part Status: Active; Operating Temperature: -55°C ~ 125°C; Ratings: -; Mounting Type: Surface Mount, MLCC; Package / Case: 0603 (1608 Metric); Size / Dimension: 0.063" L x 0.031" W (1.60mm x 0.80mm); Height - Seated (Max): -; Thickness (Max): 0.037" (0.95mm); Lead Spacing: -; Lead Style: -; ComponentLink1URL: http://www.yuden.co.jp/productdata/catalog/en/mlcc_all_e.pdf; ComponentLink1Description: http://www.yuden.co.jp/productdata/catalog/en/mlcc_all_e.pdf; Tolerance: ±10%
C32 = CAP CER 2.2UF 25V 10% X5R 0603: 2.2µF ±10% 25V Ceramic Capacitor X5R 0603 (1608 Metric); Manufacturer 1: Murata Electronics North America; Manufacturer Part Number 1: GRM188R61E225KA12D; Supplier 1: Digi-Key; Supplier Part Number 1: 490-10731-1-ND; Packaging: Cut Tape (CT); Part Status: Active; Operating Temperature: -55°C ~ 85°C; Ratings: -; Mounting Type: Surface Mount, MLCC; Package / Case: 0603 (1608 Metric); Size / Dimension: 0.063" L x 0.031" W (1.60mm x 0.80mm); Height - Seated (Max): -; Thickness (Max): 0.035" (0.90mm); Lead Spacing: -; Lead Style: -; ComponentLink1URL: http://www.murata.com/~/media/webrenewal/support/library/catalog/products/capacitor/mlcc/c02e.ashx; ComponentLink1Description: http://www.murata.com/~/media/webrenewal/support/library/catalog/products/capacitor/mlcc/c02e.ashx; Tolerance: ±10%
L1 = IND 220uH 0.59A 20%: 220µH Shielded Inductor 590mA 834 mOhm Nonstandard; Manufacturer 1: Laird-Signal Integrity Products; Manufacturer Part Number 1: TYS6045221M-10; Current - Saturation: 700mA; Frequency - Self Resonant: 3.5MHz; Supplier 1: Digi-Key; Supplier Part Number 1: 240-2742-1-ND; Packaging: Cut Tape (CT); Part Status: Active; Type: -; Material - Core: -; Current Rating: 590mA; Shielding: Shielded; DC Resistance (DCR): 834 mOhm; Q @ Freq: -; Ratings: AEC-Q200; Operating Temperature: -40°C ~ 125°C; Mounting Type: Surface Mount; Package / Case: Nonstandard; Supplier Device Package: -; Size / Dimension: 0.236" L x 0.236" W (6.00mm x 6.00mm); Height - Seated (Max): 0.185" (4.70mm); ComponentLink1URL: http://assets.lairdtech.com/home/brandworld/files/TYS6045221M-10.pdf; ComponentLink1Description: http://assets.lairdtech.com/home/brandworld/files/TYS6045221M-10.pdf; Tolerance: ±20%
R51 = RES 820 OHM 5% 1/4W 0603: RES SMD 820 OHM 5% 1/4W 0603; Manufacturer 1: Rohm Semiconductor; Manufacturer Part Number 1: ESR03EZPJ821; Temperature Coefficient: ±200ppm/°C; Supplier 1: Digi-Key; Supplier Part Number 1: RHM820DCT-ND; Packaging: Cut Tape (CT); Part Status: Active; Composition: Thick Film; Operating Temperature: -55°C ~ 155°C; Package / Case: 0603 (1608 Metric); Supplier Device Package: 0603; Size / Dimension: 0.063" L x 0.031" W (1.60mm x 0.80mm); Height - Seated (Max): 0.022" (0.55mm); Failure Rate: -; ComponentLink1URL: http://www.rohm.com/web/global/datasheet/ESR01MZPF/esr-e; ComponentLink1Description: http://www.rohm.com/web/global/datasheet/ESR01MZPF/esr-e; Tolerance: ±5%
R52 = RES 10K OHM 1% 1/10W 0603: RES SMD 10K OHM 1% 1/10W 0603; Manufacturer 1: Yageo; Manufacturer Part Number 1: RC0603FR-0710KL; Temperature Coefficient: ±100ppm/°C; Supplier 1: Digi-Key; Supplier Part Number 1: 311-10.0KHRCT-ND; Packaging: Cut Tape (CT); Part Status: Active; Composition: Thick Film; Operating Temperature: -55°C ~ 155°C; Package / Case: 0603 (1608 Metric); Supplier Device Package: 0603; Size / Dimension: 0.063" L x 0.031" W (1.60mm x 0.80mm); Height - Seated (Max): 0.022" (0.55mm); Failure Rate: -; ComponentLink1URL: http://www.yageo.com/documents/recent/PYu-RC_Group_51_RoHS_L_7.pdf; ComponentLink1Description: http://www.yageo.com/documents/recent/PYu-RC_Group_51_RoHS_L_7.pdf; Tolerance: ±1%
R53 = RES 191K OHM 1% 1/10W 0603: 191k Ohm ±1% 0.1W, 1/10W Chip Resistor 0603 (1608 Metric) Moisture Resistant Thick Film; Manufacturer 1: Yageo; Manufacturer Part Number 1: RC0603FR-07191KL; Temperature Coefficient: ±100ppm/°C; Supplier 1: Digi-Key; Supplier Part Number 1: 311-191KHRCT-ND; Packaging: Cut Tape (CT); Part Status: Active; Composition: Thick Film; Operating Temperature: -55°C ~ 155°C; Package / Case: 0603 (1608 Metric); Supplier Device Package: 0603; Size / Dimension: 0.063" L x 0.031" W (1.60mm x 0.80mm); Height - Seated (Max): 0.022" (0.55mm); Failure Rate: -; ComponentLink1URL: http://www.yageo.com/documents/recent/PYu-RC_Group_51_RoHS_L_7.pdf; ComponentLink1Description: http://www.yageo.com/documents/recent/PYu-RC_Group_51_RoHS_L_7.pdf; Tolerance: ±1%
R54 = RES 255K OHM 1% 1/10W 0603: 255k Ohm ±1% 0.1W, 1/10W Chip Resistor 0603 (1608 Metric) Moisture Resistant Thick Film; Manufacturer 1: Yageo; Manufacturer Part Number 1: RC0603FR-07255KL; Description 1: RES SMD 255K OHM 1% 1/10W 0603; Temperature Coefficient: ±100ppm/°C; Supplier 1: Digi-Key; Supplier Part Number 1: 311-255KHRCT-ND; RoHS: RoHS Compliant; Category: Resistors; Stock 1: 106564; Pricing 1: 1=0.16, 10=0.022, 100=0.0089, 1000=0.00402, 2500=0.00349 (CAD); Packaging: Cut Tape (CT); Part Status: Active; Composition: Thick Film; Features: Moisture Resistant; Operating Temperature: -55°C ~ 155°C; Package / Case: 0603 (1608 Metric); Supplier Device Package: 0603; Size / Dimension: 0.063" L x 0.031" W (1.60mm x 0.80mm); Height - Seated (Max): 0.022" (0.55mm); Failure Rate: -; ComponentLink1URL: http://www.yageo.com/documents/recent/PYu-RC_Group_51_RoHS_L_7.pdf; ComponentLink1Description: http://www.yageo.com/documents/recent/PYu-RC_Group_51_RoHS_L_7.pdf; Tolerance: ±1%
R55 = RES 39.2K OHM 1% 1/10W 0603: 39.2k Ohm ±1% 0.1W, 1/10W Chip Resistor 0603 (1608 Metric) Moisture Resistant Thick Film; Manufacturer 1: Yageo; Manufacturer Part Number 1: RC0603FR-0739K2L; Temperature Coefficient: ±100ppm/°C; Supplier 1: Digi-Key; Supplier Part Number 1: 311-39.2KHRCT-ND; Packaging: Cut Tape (CT); Part Status: Active; Composition: Thick Film; Operating Temperature: -55°C ~ 155°C; Package / Case: 0603 (1608 Metric); Supplier Device Package: 0603; Size / Dimension: 0.063" L x 0.031" W (1.60mm x 0.80mm); Height - Seated (Max): 0.022" (0.55mm); Failure Rate: -; ComponentLink1URL: http://www.yageo.com/documents/recent/PYu-RC_Group_51_RoHS_L_7.pdf; ComponentLink1Description: http://www.yageo.com/documents/recent/PYu-RC_Group_51_RoHS_L_7.pdf; Tolerance: ±1%
U3 = IC REG BUCK ADJ 0.1A 10UMAX: Buck Switching Regulator IC Positive Adjustable 0.8V 1 Output 100mA 10-TFSOP, 10-MSOP (0.118", 3.00mm Width); Manufacturer 1: Maxim Integrated; Function: Step-Down; Number of Outputs: 1; Voltage - Input (Min): 4V; Voltage - Input (Max): 60V; Voltage - Output (Max): 54V; Frequency - Switching: 100kHz ~ 2.2MHz; Synchronous Rectifier: Yes; Supplier 1: Digi-Key; Supplier Part Number 1: MAX17552AUB+-ND; Packaging: Tube; Part Status: Active; Output Configuration: Positive; Topology: Buck; Output Type: Adjustable; Voltage - Output (Min/Fixed): 0.8V; Current - Output: 100mA; Operating Temperature: -40°C ~ 125°C (TJ); Mounting Type: Surface Mount; Package / Case: 10-TFSOP, 10-MSOP (0.118", 3.00mm Width); Supplier Device Package: 10-uMAX; ComponentLink1URL: http://datasheets.maximintegrated.com/en/ds/MAX17552.pdf; ComponentLink1Description: http://datasheets.maximintegrated.com/en/ds/MAX17552.pdf
U4 = IC REG LDO 5V 0.1A SOT23-5: Linear Voltage Regulator IC Positive Fixed Output 5V 100mA SOT-23-5; Manufacturer 1: STMicroelectronics; Voltage - Dropout (Typical): 0.18V @ 100mA; Voltage - Input: Up to 16V; Supplier 1: Digi-Key; Supplier Part Number 1: 497-7787-1-ND; Packaging: Cut Tape (CT); Part Status: Active; Regulator Topology: Positive Fixed; Voltage - Output: 5V; Current - Output: 100mA; Current - Limit (Min): -; Operating Temperature: -40°C ~ 125°C; Mounting Type: Surface Mount; Package / Case: SC-74A, SOT-753; Supplier Device Package: SOT-23-5; ComponentLink1URL: http://www.st.com/content/ccc/resource/technical/document/datasheet/group1/b7/b5/a1/83/9c/bd/4a/90/CD00001635/files/CD00001635.pdf/jcr:content/translations/en.CD00001635.pdf; ComponentLink1Description: http://www.st.com/content/ccc/resource/technical/document/datasheet/group1/b7/b5/a1/83/9c/bd/4a/90/CD00001635/files/CD00001635.pdf/jcr:content/translations/en.CD00001635.pdf

## Nets that join several sheets
3V0_VREF2: BMS AFE - AFE (R44.2 U2.1 U2.4), BMS AFE - Thermistors (20 pins)
5V0: BMS AFE - AFE (11 pins), BMS AFE - Thermistors (6 pins), BMS AFE - Regulator (C32.1 U4.5)
VBAT+: BMS AFE - AFE (R34#1.1 R38#1.1), BMS AFE - Cell Inputs (R1.1), BMS AFE - Connectors (P2.1)
VBAT-: BMS AFE - AFE (12 pins), BMS AFE - Cell Inputs (14 pins), BMS AFE - Connectors (P3.8)
AFE_CELL_INPUT_0: BMS AFE - AFE (U1.26), BMS AFE - Cell Inputs (C4.1 D4.3 R6.2)
AFE_CELL_INPUT_1: BMS AFE - AFE (U1.24), BMS AFE - Cell Inputs (C13.1 D4.2 D4.4 R5.5)
AFE_CELL_INPUT_2: BMS AFE - AFE (U1.22), BMS AFE - Cell Inputs (C10.1 D4.1 D4.5 R5.6)
AFE_CELL_INPUT_3: BMS AFE - AFE (U1.20), BMS AFE - Cell Inputs (C7.1 D3.3 D4.6 R5.7)
AFE_CELL_INPUT_4: BMS AFE - AFE (U1.18), BMS AFE - Cell Inputs (C3.1 D3.2 D3.4 R5.8)
AFE_CELL_INPUT_5: BMS AFE - AFE (U1.16), BMS AFE - Cell Inputs (C12.1 D3.1 D3.5 R4.5)
AFE_CELL_INPUT_6: BMS AFE - AFE (U1.14), BMS AFE - Cell Inputs (C9.1 D2.3 D3.6 R4.6)
AFE_CELL_INPUT_7: BMS AFE - AFE (U1.12), BMS AFE - Cell Inputs (C6.1 D2.2 D2.4 R4.7)
AFE_CELL_INPUT_8: BMS AFE - AFE (U1.10), BMS AFE - Cell Inputs (C2.1 D2.1 D2.5 R4.8)
AFE_CELL_INPUT_9: BMS AFE - AFE (U1.8), BMS AFE - Cell Inputs (C11.1 D1.3 D2.6 R3.5)
AFE_CELL_INPUT_10: BMS AFE - AFE (U1.6), BMS AFE - Cell Inputs (C8.1 D1.2 D1.4 R3.6)
AFE_CELL_INPUT_11: BMS AFE - AFE (U1.4), BMS AFE - Cell Inputs (C5.1 D1.1 D1.5 R3.7)
AFE_CELL_INPUT_12: BMS AFE - AFE (U1.2), BMS AFE - Cell Inputs (C1.1 D1.6 R3.8)
AFE_TEMP_MUX_DIN: BMS AFE - AFE (R35#1.1 U1.32), BMS AFE - Thermistors (U6.18)
AFE_TEMP_MUX_~{SYNC}: BMS AFE - AFE (R36#1.1 U1.29), BMS AFE - Thermistors (U6.17)
AFE_TEMP_MUX_SCLK: BMS AFE - AFE (R33#1.1 U1.33), BMS AFE - Thermistors (U6.19)
BAL_CONTROL_1: BMS AFE - AFE (U1.25), BMS AFE - Cell Balancing (R40#2.10)
BAL_CONTROL_2: BMS AFE - AFE (U1.23), BMS AFE - Cell Balancing (R40#2.11)
BAL_CONTROL_3: BMS AFE - AFE (U1.21), BMS AFE - Cell Balancing (R40#2.12)
BAL_CONTROL_4: BMS AFE - AFE (U1.19), BMS AFE - Cell Balancing (R40#2.13)
BAL_CONTROL_5: BMS AFE - AFE (U1.17), BMS AFE - Cell Balancing (R40#2.14)
BAL_CONTROL_6: BMS AFE - AFE (U1.15), BMS AFE - Cell Balancing (R40#2.15)
BAL_CONTROL_7: BMS AFE - AFE (U1.13), BMS AFE - Cell Balancing (R27.10)
BAL_CONTROL_8: BMS AFE - AFE (U1.11), BMS AFE - Cell Balancing (R27.11)
BAL_CONTROL_9: BMS AFE - AFE (U1.9), BMS AFE - Cell Balancing (R27.12)
BAL_CONTROL_10: BMS AFE - AFE (U1.7), BMS AFE - Cell Balancing (R27.13)
BAL_CONTROL_11: BMS AFE - AFE (U1.5), BMS AFE - Cell Balancing (R27.14)
BAL_CONTROL_12: BMS AFE - AFE (U1.3), BMS AFE - Cell Balancing (R27.15)
BAL_INPUT_0: BMS AFE - Cell Balancing (F13.1), BMS AFE - Connectors (P3.15)
BAL_INPUT_1: BMS AFE - Cell Balancing (F12.1), BMS AFE - Connectors (P3.14)
BAL_INPUT_2: BMS AFE - Cell Balancing (F11.1), BMS AFE - Connectors (P3.13)
BAL_INPUT_3: BMS AFE - Cell Balancing (F10.1), BMS AFE - Connectors (P3.12)
BAL_INPUT_4: BMS AFE - Cell Balancing (F9.1), BMS AFE - Connectors (P3.11)
BAL_INPUT_5: BMS AFE - Cell Balancing (F8.1), BMS AFE - Connectors (P3.10)
BAL_INPUT_6: BMS AFE - Cell Balancing (F7.1), BMS AFE - Connectors (P3.9)
BAL_INPUT_7: BMS AFE - Cell Balancing (F6.1), BMS AFE - Connectors (P2.14)
BAL_INPUT_8: BMS AFE - Cell Balancing (F5.1), BMS AFE - Connectors (P2.13)
BAL_INPUT_9: BMS AFE - Cell Balancing (F4.1), BMS AFE - Connectors (P2.12)
BAL_INPUT_10: BMS AFE - Cell Balancing (F3.1), BMS AFE - Connectors (P2.11)
BAL_INPUT_11: BMS AFE - Cell Balancing (F2.1), BMS AFE - Connectors (P2.10)
BAL_INPUT_12: BMS AFE - Cell Balancing (F1.1), BMS AFE - Connectors (P2.9)
CELL_INPUT_0: BMS AFE - Cell Inputs (R2.1 R6.1), BMS AFE - Connectors (P3.7)
CELL_INPUT_1: BMS AFE - Cell Inputs (R5.4), BMS AFE - Connectors (P3.6)
CELL_INPUT_2: BMS AFE - Cell Inputs (R5.3), BMS AFE - Connectors (P3.5)
CELL_INPUT_3: BMS AFE - Cell Inputs (R5.2), BMS AFE - Connectors (P3.4)
CELL_INPUT_4: BMS AFE - Cell Inputs (R5.1), BMS AFE - Connectors (P3.3)
CELL_INPUT_5: BMS AFE - Cell Inputs (R4.4), BMS AFE - Connectors (P3.2)
CELL_INPUT_6: BMS AFE - Cell Inputs (R4.3), BMS AFE - Connectors (P3.1)
CELL_INPUT_7: BMS AFE - Cell Inputs (R4.2), BMS AFE - Connectors (P2.7)
CELL_INPUT_8: BMS AFE - Cell Inputs (R4.1), BMS AFE - Connectors (P2.6)
CELL_INPUT_9: BMS AFE - Cell Inputs (R3.4), BMS AFE - Connectors (P2.5)
CELL_INPUT_10: BMS AFE - Cell Inputs (R3.3), BMS AFE - Connectors (P2.4)
CELL_INPUT_11: BMS AFE - Cell Inputs (R3.2), BMS AFE - Connectors (P2.3)
CELL_INPUT_12: BMS AFE - Cell Inputs (R1.2 R3.1), BMS AFE - Connectors (P2.2)
IA_N: BMS AFE - AFE (R43.1 U1.41), BMS AFE - Communications (R50.2 XFMR1.8)
IA_P: BMS AFE - AFE (R41.1 U1.42), BMS AFE - Communications (R49.1 XFMR1.6)
IB_N: BMS AFE - AFE (U1.47), BMS AFE - Communications (R48.2 XFMR1.3)
IB_P: BMS AFE - AFE (U1.48), BMS AFE - Communications (R47.1 XFMR1.1)
ISOSPI_IA_N: BMS AFE - Communications (XFMR1.9), BMS AFE - Connectors (P5.1)
ISOSPI_IA_P: BMS AFE - Communications (XFMR1.11), BMS AFE - Connectors (P5.2)
ISOSPI_IB_N: BMS AFE - Communications (XFMR1.14), BMS AFE - Connectors (P6.1)
ISOSPI_IB_P: BMS AFE - Communications (XFMR1.16), BMS AFE - Connectors (P6.2)
NetC34_1: BMS AFE - AFE (U1.27), BMS AFE - Thermistors (C34.1 R60.2)
NetP7_1: BMS AFE - AFE (R43.2), BMS AFE - Connectors (P7.1)
NetP7_2: BMS AFE - AFE (R41.2), BMS AFE - Connectors (P7.2)
NetP7_3: BMS AFE - AFE (U1.43), BMS AFE - Connectors (P7.3)
NetP7_4: BMS AFE - AFE (R39#1.2 U1.44), BMS AFE - Connectors (P7.4)
NetR52_1: BMS AFE - AFE (U1.38), BMS AFE - Regulator (R52.1 U3.2)

## Assembly variants
01 - Standard: not fitted P5 R2 R9 R10 R11 R51 R65 R80